# EAGLE design Ver.5 中継 (EAGLE 9.6.2)
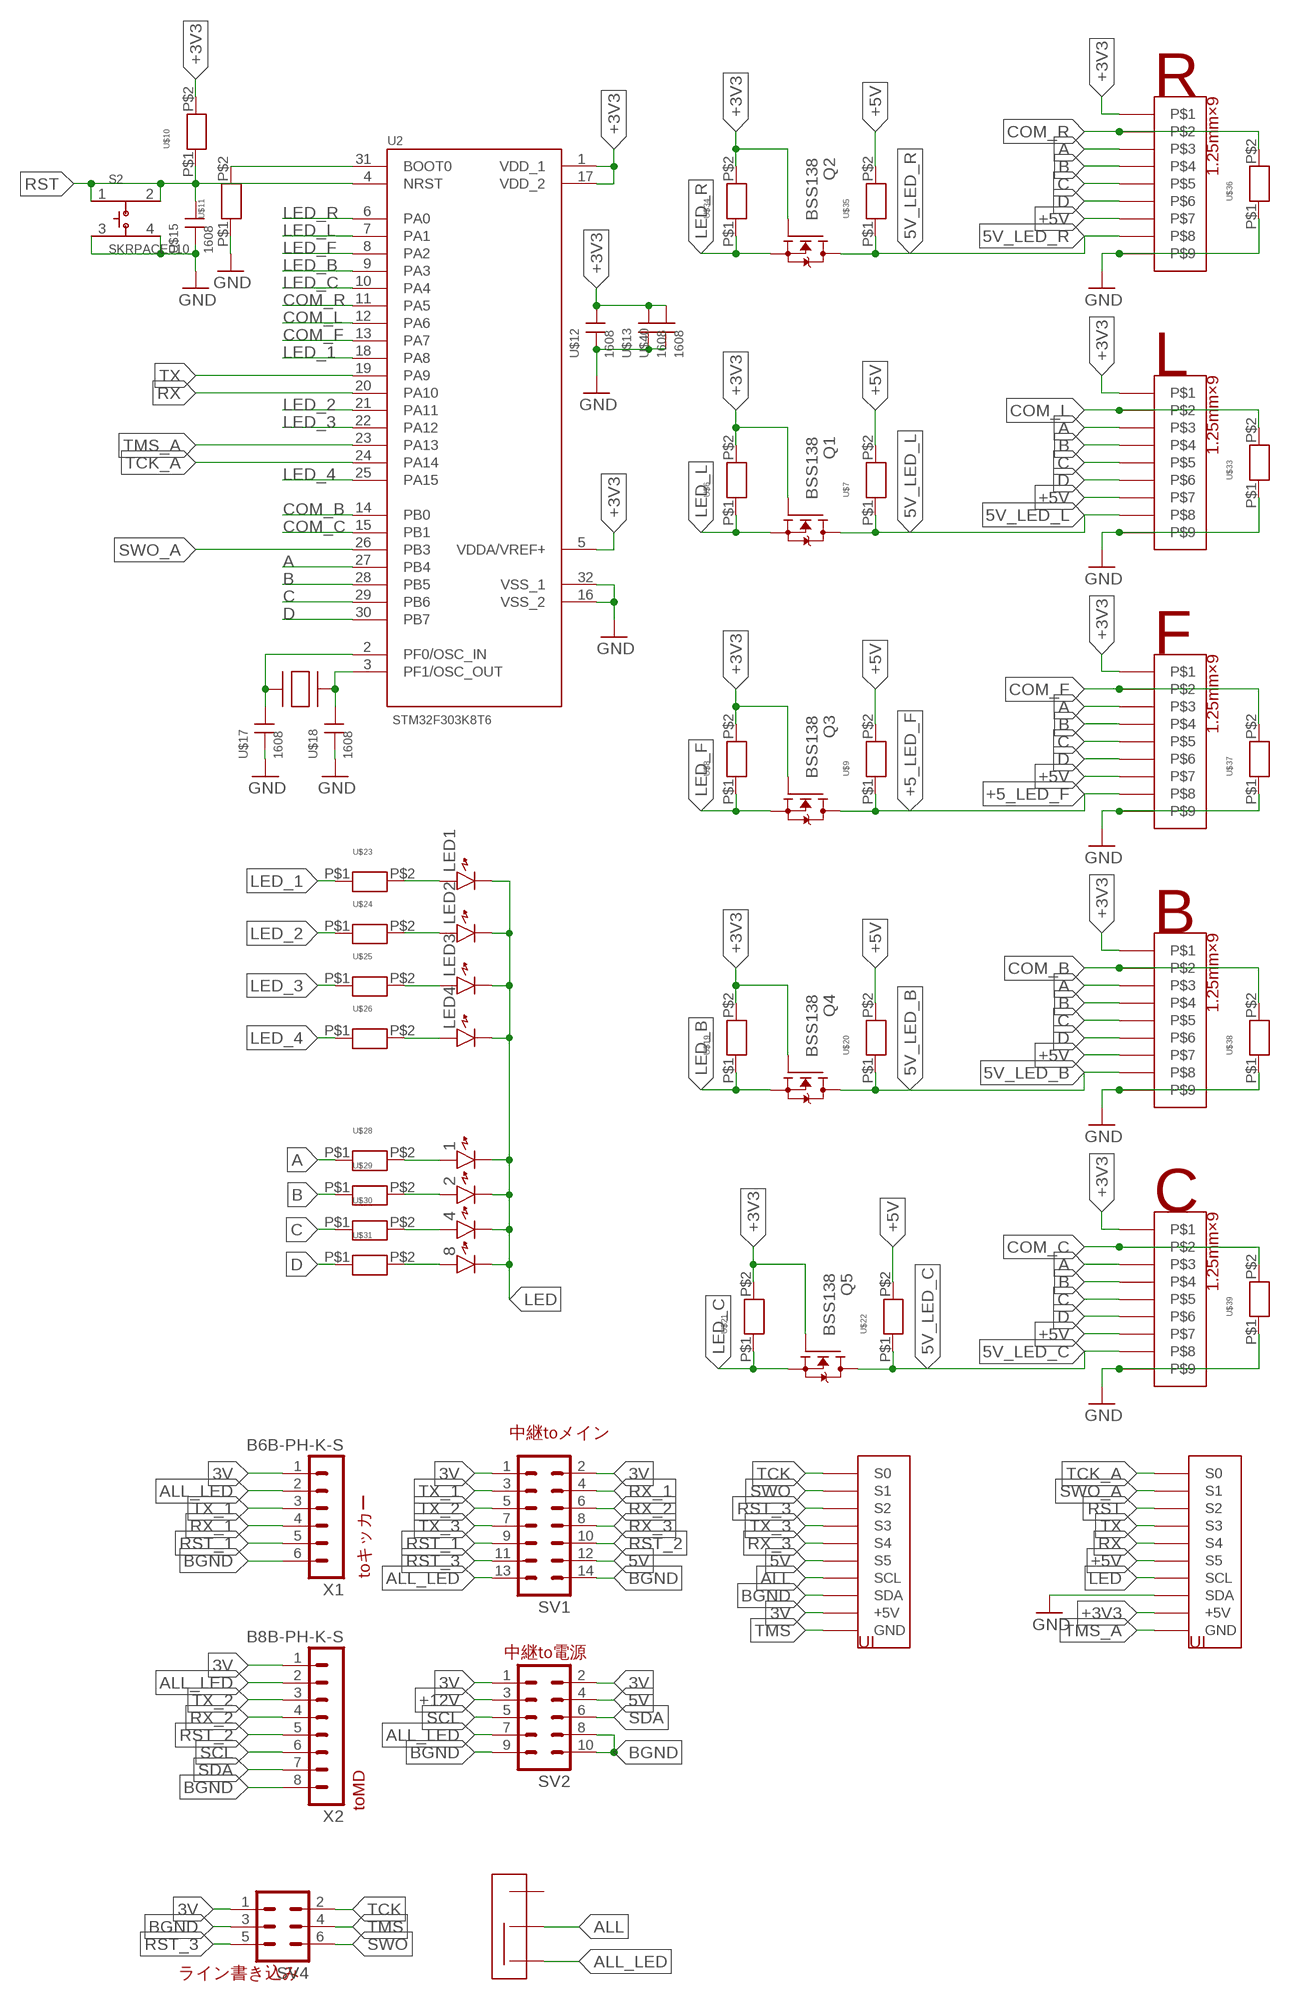
[diagram p0: schematic, sheet 1]

## Parts
1  LED1608  [LED1608]
2  LED1608  [LED1608]
4  LED1608  [LED1608]
8  LED1608  [LED1608]
LED1  LED1608  [LED1608]
LED2  LED1608  [LED1608]
LED3  LED1608  [LED1608]
LED4  LED1608  [LED1608]
Q1  BSS138  [SOT23]
Q2  BSS138  [SOT23]
Q3  BSS138  [SOT23]
Q4  BSS138  [SOT23]
Q5  BSS138  [SOT23]
S2  SKRPACE010  [SW_SKRPACE010]
SV1  ML14  [ML14]
SV2  ML10  [ML10]
SV4  ML6  [ML6]
U2  STM32F303K8T6  [QFP80P900X900X160-32N]
U$1  1MMCON  [1MMCON]
U$2  1MMCON  [1MMCON]
U$3  1MMCON  [1MMCON]
U$4  1MMCON  [1MMCON]
U$5  1MMCON  [1MMCON]
U$6  R  [1608]
U$7  R  [1608]
U$8  R  [1608]
U$9  R  [1608]
U$10  R  [1608]
U$11  R  [1608]
U$12  1608  [CON]
U$13  1608  [CON]
U$14  UI  [UI]
U$15  1608  [CON]
U$16  SUISYOU  [水晶]
U$17  1608  [CON]
U$18  1608  [CON]
U$19  R  [1608]
U$20  R  [1608]
U$21  R  [1608]
U$22  R  [1608]
U$23  R  [1608]
U$24  R  [1608]
U$25  R  [1608]
U$26  R  [1608]
U$27  UI  [UI]
U$28  R  [1608]
U$29  R  [1608]
U$30  R  [1608]
U$31  R  [1608]
U$32  SSW  [SSW]
U$33  R  [1608]
U$34  R  [1608]
U$35  R  [1608]
U$36  R  [1608]
U$37  R  [1608]
U$38  R  [1608]
U$39  R  [1608]
U$40  1608  [CON]
X1  B6B-PH-K-S  [B6B-PH-K-S]
X2  B8B-PH-K-S  [B8B-PH-K-S]

## Nets
3V: SV1.1 SV1.2 SV2.1 SV2.2 SV4.1 U$14.P$1(+5V) X1.1 X2.1
5V: SV1.12 SV2.4 U$14.P$8(S5)
5V_LED_B: Q4.3(D) U$4.P$8 U$20.P$1
5V_LED_C: Q5.3(D) U$5.P$8 U$22.P$1
5V_LED_L: Q1.3(D) U$2.P$8 U$7.P$1
5V_LED_R: Q2.3(D) U$1.P$8 U$35.P$1
+3V3 [New Class]: Q1.1(G) Q2.1(G) Q3.1(G) Q4.1(G) Q5.1(G) U2.1(VDD_1) U2.5(VDDA/VREF+) U2.17(VDD_2) U$1.P$1 U$2.P$1 U$3.P$1 U$4.P$1 U$5.P$1 U$6.P$2 U$8.P$2 U$10.P$2 U$12.P$1 U$13.P$1 U$19.P$2 U$21.P$2 U$27.P$1(+5V) U$34.P$2 U$40.P$1
+5_LED_F: Q3.3(D) U$3.P$8 U$9.P$1
+5V: U$1.P$7 U$2.P$7 U$3.P$7 U$4.P$7 U$5.P$7 U$7.P$2 U$9.P$2 U$20.P$2 U$22.P$2 U$27.P$8(S5) U$35.P$2
+12V: SV2.3
A: U2.27(PB4) U$1.P$3 U$2.P$3 U$3.P$3 U$4.P$3 U$5.P$3 U$28.P$1
ALL: U$14.P$9(SCL) U$32.P$3
ALL_LED [New Class]: SV1.13 SV2.7 U$32.P$1 X1.2 X2.2
B: U2.28(PB5) U$1.P$4 U$2.P$4 U$3.P$4 U$4.P$4 U$5.P$4 U$29.P$1
BGND: SV1.14 SV2.8 SV2.9 SV2.10 SV4.3 U$14.P$10(SDA) X1.6 X2.8
C: U2.29(PB6) U$1.P$5 U$2.P$5 U$3.P$5 U$4.P$5 U$5.P$5 U$30.P$1
COM_B: U2.14(PB0) U$4.P$2 U$38.P$2
COM_C: U2.15(PB1) U$5.P$2 U$39.P$2
COM_F: U2.13(PA7) U$3.P$2 U$37.P$2
COM_L: U2.12(PA6) U$2.P$2 U$33.P$2
COM_R: U2.11(PA5) U$1.P$2 U$36.P$2
D: U2.30(PB7) U$1.P$6 U$2.P$6 U$3.P$6 U$4.P$6 U$5.P$6 U$31.P$1
GND [New Class]: S2.3 S2.4 U2.16(VSS_2) U2.32(VSS_1) U$1.P$9 U$2.P$9 U$3.P$9 U$4.P$9 U$5.P$9 U$11.P$1 U$12.P$2 U$13.P$2 U$15.P$2 U$17.P$2 U$18.P$2 U$27.P$10(SDA) U$33.P$1 U$36.P$1 U$37.P$1 U$38.P$1 U$39.P$1 U$40.P$2
LED: 1.K 2.K 4.K 8.K LED1.K LED2.K LED3.K LED4.K U$27.P$9(SCL)
LED_1: U2.18(PA8) U$23.P$1
LED_2: U2.21(PA11) U$24.P$1
LED_3: U2.22(PA12) U$25.P$1
LED_4: U2.25(PA15) U$26.P$1
LED_B: Q4.2(S) U2.9(PA3) U$19.P$1
LED_C: Q5.2(S) U2.10(PA4) U$21.P$1
LED_F: Q3.2(S) U2.8(PA2) U$8.P$1
LED_L: Q1.2(S) U2.7(PA1) U$6.P$1
LED_R: Q2.2(S) U2.6(PA0) U$34.P$1
N$1: U2.31(BOOT0) U$11.P$2
N$2: U2.2(PF0/OSC_IN) U$16.P$1 U$17.P$1
N$3: U2.3(PF1/OSC_OUT) U$16.P$2 U$18.P$1
N$9: 8.A U$31.P$2
N$10: 4.A U$30.P$2
N$11: 2.A U$29.P$2
N$12: 1.A U$28.P$2
N$19: LED2.A U$24.P$2
N$20: LED1.A U$23.P$2
N$21: LED3.A U$25.P$2
N$22: LED4.A U$26.P$2
RST: S2.1 S2.2 U2.4(NRST) U$10.P$1 U$15.P$1 U$27.P$5(S2)
RST_1: SV1.9 X1.5
RST_2: SV1.10 X2.5
RST_3: SV1.11 SV4.5 U$14.P$5(S2)
RX: U2.20(PA10) U$27.P$7(S4)
RX_1: SV1.4 X1.4
RX_2: SV1.6 X2.4
RX_3: SV1.8 U$14.P$7(S4)
SCL: SV2.5 X2.6
SDA: SV2.6 X2.7
SWO: SV4.6 U$14.P$4(S1)
SWO_A: U2.26(PB3) U$27.P$4(S1)
TCK: SV4.2 U$14.P$3(S0)
TCK_A: U2.24(PA14) U$27.P$3(S0)
TMS: SV4.4 U$14.P$2(GND)
TMS_A: U2.23(PA13) U$27.P$2(GND)
TX: U2.19(PA9) U$27.P$6(S3)
TX_1: SV1.3 X1.3
TX_2: SV1.5 X2.3
TX_3: SV1.7 U$14.P$6(S3)
Unconnected: U$32.P$2

## Notes on the sheet
- R
- L
- F
- B
- C
- 中継toメイン
- toキッカー
- 中継to電源
- toMD
- ライン書き込み

## Library data of the parts
1 2 4 8 LED1-LED4 = generic:LED: Generic LEDs
Q1-Q5 = bss138_10:BSS138: BSS138 N-Channel Logic Level Enhancement Mode Field Effect Transistor Source: http://www.fairchildsemi.com/datasheets/BS/BSS138.pdf; MF: Fairchild; MPN: BSS138; OC_FARNELL: 9845330; OC_NEWARK: 67R2009
S2 = SKRPACE010:SKRPACE010: Switch Tactile N.O. SPST Button J-Bend 0.05A 16VDC 2.55N SMD Automotive T/R Check prices <https://pricing.snapeda.com/parts/SKRPACE010/ALPS/view-part?ref=eda>; AVAILABILITY: In Stock; DESCRIPTION: Switch Tactile N.O. SPST Button J-Bend 0.05A 16VDC 2.55N SMD Automotive T/R; MF: ALPS; MP: SKRPACE010; PACKAGE: None; PRICE: None
SV1 = con-ml:ML14: HARTING; OC_FARNELL: unknown; OC_NEWARK: unknown
SV2 = con-ml:ML10: HARTING; OC_FARNELL: unknown; OC_NEWARK: unknown
SV4 = con-ml:ML6: HARTING; OC_FARNELL: unknown; OC_NEWARK: unknown
U2 = STM32F303K8T6:STM32F303K8T6: Analog and DSP with FPU ARM Cortex-M4 MCU with 64 Kbytes Flash, 72 MHz CPU, CCM, 12-bit ADC 5 MSPS, comparators, op-amp Check availability <https://pricing.snapeda.com/parts/STM32F303K8T6/STMicroelectronics/view-part?ref=eda>; AVAILABILITY: In Stock; DESCRIPTION: ARM® Cortex®-M4 STM32F3 Microcontroller IC 32-Bit 72MHz 64KB (64K x 8) FLASH 32-LQFP (7x7); MF: STMicroelectronics; MP: STM32F303K8T6; PACKAGE: LQFP-32 STMicroelectronics; PRICE: None; PURCHASE-URL: https://pricing.snapeda.com/search/part/STM32F303K8T6/?ref=eda
U$1-U$5 = 9P_1.25mmCON:1MMCON
U$6-U$11 U$19-U$26 U$28-U$31 U$33-U$39 = R 1608:R
U$12 U$13 U$15 U$17 U$18 U$40 = con1608:1608
U$14 U$27 = UI:UI
U$16 = 水晶:SUISYOU
U$32 = SSW:SSW
X1 = con-JST PH:B6B-PH: JST PH series header 2.00mm pitch disconnectable crimp style connectors, vertical (side entry type), 6 pins
X2 = con-JST PH:B8B-PH: JST PH series header 2.00mm pitch disconnectable crimp style connectors, vertical (side entry type), 8 pins

## Net classes
1 New Class: width 0.254 mm

## Board
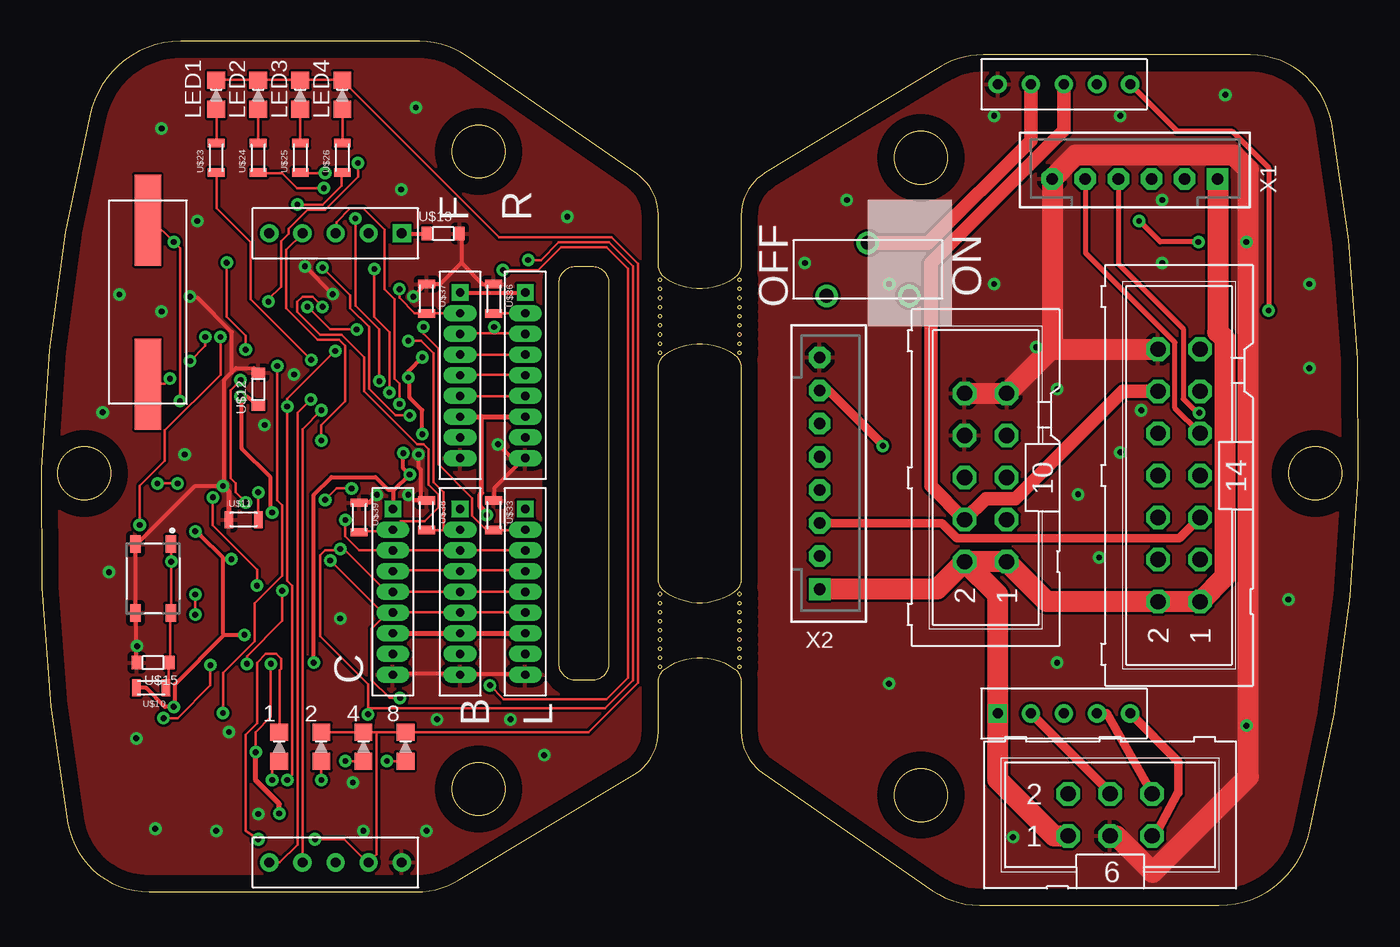
[diagram p1: board, top side]
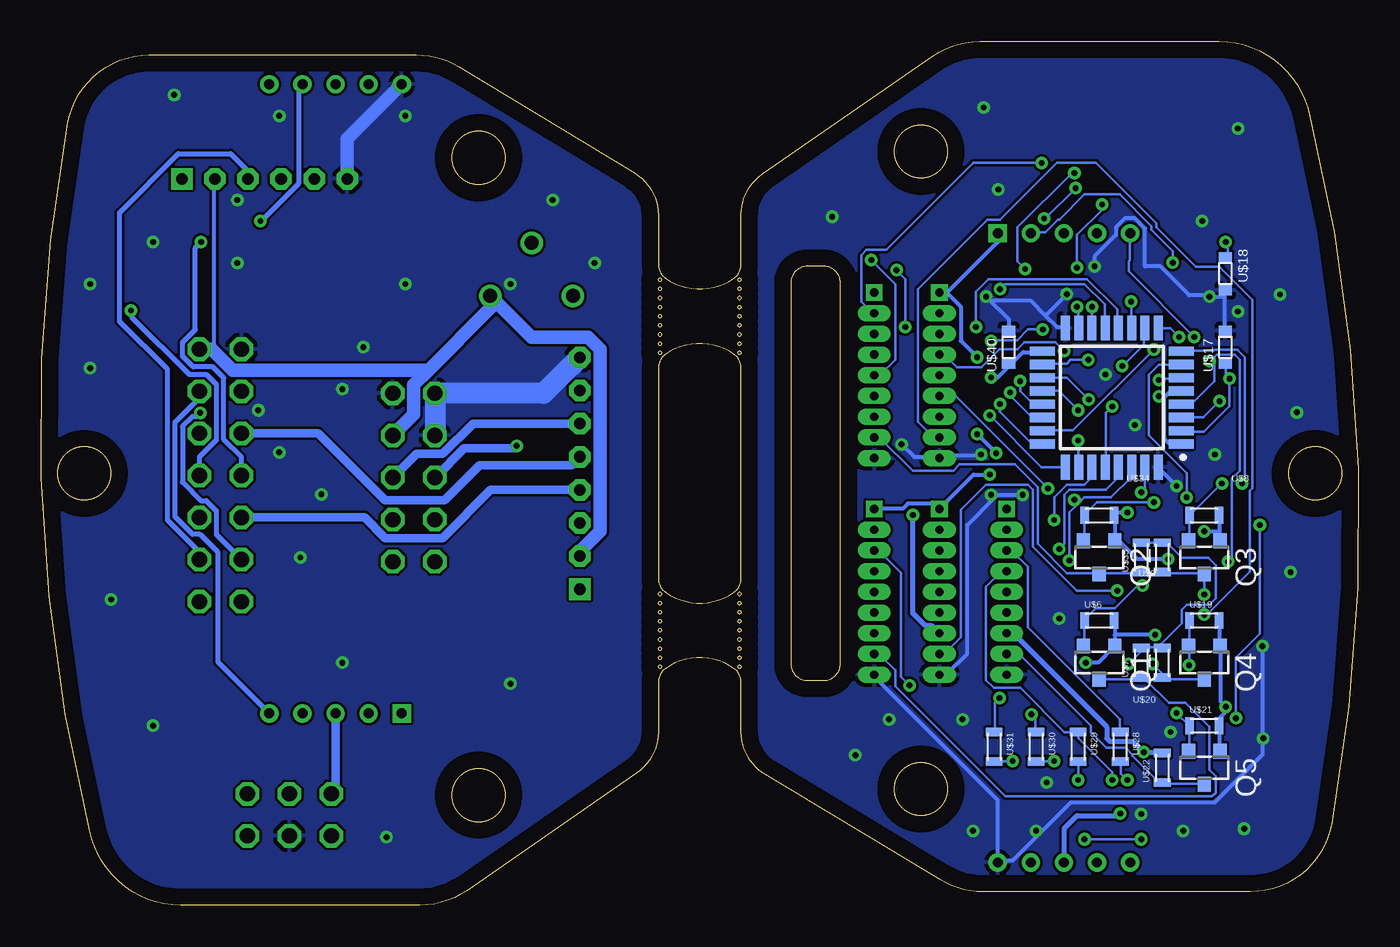
[diagram p2: board, bottom side, seen from below]

Size 79.54 x 52.17 mm. Coordinates in mm from the lower left corner, seen from the top.
Outline: 33.27,13.58 32.27,13.58 arc-90 31.27,14.58 31.27,37.58 arc-90 32.27,38.58 33.27,38.58 arc-90 34.27,37.58 34.27,14.58 arc-90 33.27,13.58
Outline: 37.7,14.3 arc-70 41.84,14.3 arc-55 42.27,13.48 42.27,10.47 arc55 43.56,8.01 53.84,0.89 arc35 56.69,0 71.14,0 arc79 76.62,4.51 arc24 77.94,47.25 arc80 73.02,51.36 56.9,51.36 arc31 54.31,50.64 43.72,44.22 arc59 42.27,41.66 42.27,38.69 arc-55 41.84,37.87 arc-70 37.7,37.87 arc-55 37.27,38.69 37.27,41.7 arc55 35.98,44.16 25.7,51.28 arc35 22.86,52.17 8.41,52.17 arc79 2.93,47.66 arc24 1.6,4.92 arc80 6.52,0.81 22.64,0.81 arc31 25.23,1.53 35.98,8.01 arc55 37.27,10.47 37.27,13.48 arc-55 37.7,14.3
Outline: 41.84,18.9 arc-70 37.7,18.9 arc-55 37.27,19.72 37.27,32.45 arc-55 37.7,33.27 arc-70 41.84,33.27 arc-55 42.27,32.45 42.27,19.72 arc-55 41.84,18.9
Outline: circle at 53.13,6.65 radius 1.6
Outline: circle at 42.17,14.4 radius 0.1
Outline: circle at 42.17,14.95 radius 0.1
Outline: circle at 42.17,15.5 radius 0.1
Outline: circle at 42.17,16.05 radius 0.1
Outline: circle at 42.17,16.6 radius 0.1
Outline: circle at 42.17,17.15 radius 0.1
Outline: circle at 42.17,17.7 radius 0.1
Outline: circle at 42.17,18.25 radius 0.1
Outline: circle at 42.17,18.8 radius 0.1
Outline: circle at 37.37,14.4 radius 0.1
Outline: circle at 37.37,14.95 radius 0.1
Outline: circle at 37.37,15.5 radius 0.1
Outline: circle at 37.37,16.05 radius 0.1
Outline: circle at 37.37,16.6 radius 0.1
Outline: circle at 37.37,17.15 radius 0.1
Outline: circle at 37.37,18.8 radius 0.1
Outline: circle at 37.37,18.25 radius 0.1
Outline: circle at 37.37,17.7 radius 0.1
Outline: circle at 42.17,33.92 radius 0.1
Copper layers (1*16): Top 0.035mm / dielectric 1.5mm / Bottom 0.035mm
Design rules "default": minimum track width 6mil, minimum drill 0.35mm, track to track 6mil, track to pad 6mil, pad to pad 6mil, via to via 6mil, smd to smd 6mil, copper to edge 40mil, drill to drill 6mil, minimum pad ring 10mil, minimum via ring 8mil, stop-mask expansion 4mil, vias tented up to drill 0mil, thermal gap 10mil

### Footprints (pad centres in the part's own frame; a part is rotated, then mirrored left to right if it is on the bottom)
LED1608 = smd 1.05 x 1.08: A -0.875,0; K 0.875,0
SOT23 = smd 0.8 x 0.9: 1 -0.95,-1; 2 0.95,-1; 3 0,1
SW_SKRPACE010 = smd 1.05 x 0.65: 1 -2.075,1.075; 2 2.075,1.075; 3 -2.075,-1.075; 4 2.075,-1.075
ML14 = drill 0.914 octagon: 1 -7.62,-1.27; 2 -7.62,1.27; 3 -5.08,-1.27; 4 -5.08,1.27; 5 -2.54,-1.27; 6 -2.54,1.27; 7 0,-1.27; 8 0,1.27; 9 2.54,-1.27; 10 2.54,1.27; 11 5.08,-1.27; 12 5.08,1.27; 13 7.62,-1.27; 14 7.62,1.27
ML10 = drill 0.914 octagon: 1 -5.08,-1.27; 2 -5.08,1.27; 3 -2.54,-1.27; 4 -2.54,1.27; 5 0,-1.27; 6 0,1.27; 7 2.54,-1.27; 8 2.54,1.27; 9 5.08,-1.27; 10 5.08,1.27
ML6 = drill 0.914 octagon: 1 -2.54,-1.27; 2 -2.54,1.27; 3 0,-1.27; 4 0,1.27; 5 2.54,-1.27; 6 2.54,1.27
QFP80P900X900X160-32N = smd 1.5 x 0.55: 1 -4.2,2.8; 2 -4.2,2; 3 -4.2,1.2; 4 -4.2,0.4; 5 -4.2,-0.4; 6 -4.2,-1.2; 7 -4.2,-2; 8 -4.2,-2.8; 17 4.2,-2.8; 18 4.2,-2; 19 4.2,-1.2; 20 4.2,-0.4; 21 4.2,0.4; 22 4.2,1.2; 23 4.2,2; 24 4.2,2.8 | smd 0.55 x 1.5: 9 -2.8,-4.2; 10 -2,-4.2; 11 -1.2,-4.2; 12 -0.4,-4.2; 13 0.4,-4.2; 14 1.2,-4.2; 15 2,-4.2; 16 2.8,-4.2; 25 2.8,4.2; 26 2,4.2; 27 1.2,4.2; 28 0.4,4.2; 29 -0.4,4.2; 30 -1.2,4.2; 31 -2,4.2; 32 -2.8,4.2
1MMCON = drill 0.5 square: P$1 0,0 | drill 0.5 long: P$2 1.25,0; P$3 2.5,0; P$4 3.75,0; P$5 5,0; P$6 6.25,0; P$7 7.5,0; P$8 8.75,0; P$9 10,0
1608 = smd 0.508 x 1.016: P$1 -0.889,0; P$2 0.889,0
CON = smd 0.6 x 0.813: P$1 -1,0; P$2 1,0
UI = drill 0.6 square: P$1 1,-1.5 | drill 0.6: P$2 3,-1.5; P$3 5,-1.5; P$4 7,-1.5; P$5 9,-1.5; P$6 9,36.5; P$7 7,36.5; P$8 5,36.5; P$9 3,36.5; P$10 1,36.5
水晶 = smd 5.5 x 1.6: P$1 1.2,2.35; P$2 11.1,2.35
SSW = drill 0.85: P$1 -2.5,1.6; P$2 2.5,1.6; P$3 0,-1.6
B6B-PH-K-S = drill 0.7 pad 1.3 square: 1 5,0 | drill 0.7 pad 1.3 octagon: 2 3,0; 3 1,0; 4 -1,0; 5 -3,0; 6 -5,0
B8B-PH-K-S = drill 0.7 pad 1.3 square: 1 7,0 | drill 0.7 pad 1.3 octagon: 2 5,0; 3 3,0; 4 1,0; 5 -1,0; 6 -3,0; 7 -5,0; 8 -7,0

### Placement (x,y rotation side)
1  14.37,9.57 90 top
2  16.91,9.57 90 top
4  19.45,9.57 90 top
8  21.99,9.57 90 top
LED1  10.56,48.94 90 top
LED2  13.1,48.94 90 top
LED3  15.64,48.94 90 top
LED4  18.18,48.94 90 top
Q1  15.64,14.65 180 bottom
Q2  15.64,21 180 bottom
Q3  9.29,21 180 bottom
Q4  9.29,14.65 180 bottom
Q5  9.29,8.3 180 bottom
S2  6.75,19.73 270 top
SV1  68.73,25.96 90 top
SV2  57.04,25.83 90 top
SV4  64.56,5.46 0 top
U2  14.88,30.66 180 bottom
U$1  29.23,37.01 270 top
U$2  29.23,23.93 270 top
U$3  25.29,37.01 270 top
U$4  25.29,23.93 270 top
U$5  21.23,23.93 270 top
U$6  15.64,17.19 0 bottom
U$7  13.1,14.65 90 bottom
U$8  9.29,23.54 0 bottom
U$9  11.83,21 90 bottom
U$10  6.63,13.13 180 top
U$11  12.21,23.29 0 top
U$12  13.1,31.16 90 top
U$13  24.28,40.56 0 top
U$14  56.77,13.08 0 top
U$15  6.75,14.65 180 top
U$16  8.78,30.28 90 top
U$17  8.02,33.7 90 bottom
U$18  8.02,38.15 270 bottom
U$19  9.29,17.19 0 bottom
U$20  11.83,14.65 90 bottom
U$21  9.29,10.84 0 bottom
U$22  11.83,8.3 90 bottom
U$23  10.56,45.13 90 top
U$24  13.1,45.13 90 top
U$25  15.64,45.13 90 top
U$26  18.18,45.13 90 top
U$27  22.77,39.08 180 top
U$28  14.37,9.57 270 bottom
U$29  16.91,9.57 270 bottom
U$30  19.45,9.57 270 bottom
U$31  21.99,9.57 270 bottom
U$32  49.93,38.4 180 top
U$33  27.33,23.54 270 top
U$34  15.64,23.54 0 bottom
U$35  13.1,21 90 bottom
U$36  27.33,36.63 270 top
U$37  23.26,36.63 270 top
U$38  23.26,23.54 270 top
U$39  19.2,23.42 270 top
U$40  21.1,33.7 90 bottom
X1  66.06,43.86 0 top
X2  47.01,26.08 270 top

### Tracks (layer width: path | path; a pad name or v marks a point on that pad's centre or on a via)
3V
  Top 1.27: X1.1 71.06,34.63 71.5,34.2 71.5,19.84 SV1.1 SV1.2 60.73,18.34 SV2.1 SV2.2 | SV2.2 54.11,19.08 X2.1 | SV2.2 57.77,18.75 U$14.P$1 57.77,7.58 61.18,4.17 62.04,4.17 SV4.1
5V
  Top 0.813: SV1.12 65.32,31.04 58.84,24.56 57.04,24.56 SV2.4 53.74,25.32 53.74,38.78 61.77,46.81 U$14.P$8
5V_LED_B  (via drill 0.35)
  Top 0.152: v12.42,14.58 12.42,15.04 14.55,17.17 v14.55,19
  Bottom 0.152: Q4.3 11.73,13.66 U$20.P$1 11.88,13.82 11.88,14.04 v12.42,14.58 | v14.55,19 16.99,19 19.66,21.66 19.66,25.09 19.96,25.4 22.48,25.4 24,23.87 24,16.18 24.99,15.19 25.29,15.19 U$4.P$8
5V_LED_C
  Bottom 0.152: Q5.3 9.29,7.34 11.73,7.34 11.81,7.42 U$22.P$1 12.04,7.42 13.64,9.02 13.64,9.09 14.04,9.5 15.21,9.5 16.15,10.44 16.15,10.84 20.42,15.11 21.18,15.11 U$5.P$8
5V_LED_L
  Bottom 0.152: Q1.3 15.62,13.66 13.18,13.66 13.1,13.74 U$7.P$1 13.1,13.66 12.87,13.66 11.43,12.22 10.44,12.22 8.99,10.77 8.99,8.18 8.61,7.8 8.61,6.81 8.84,6.58 21.31,6.58 27.96,13.23 27.96,14.2 28.88,15.11 29.18,15.11 U$2.P$8
5V_LED_R
  Bottom 0.152: U$35.P$1 13.1,20.06 15.62,20.06 Q2.3 15.69,20.06 17.6,20.06 19.35,21.82 19.35,25.25 20.72,26.62 24.08,26.62 24.46,26.24 26.89,26.24 28.88,28.22 29.18,28.22 U$1.P$8
+3V3  (via drill 0.35)
  Top 0.254: U$13.P$1 21.79,40.56 U$27.P$1 | v23.01,33.09 22.17,32.26 v22.17,31.88 22.25,31.8 22.25,30.66 23.01,29.89 v23.01,28.45 | U$1.P$1 29.18,36.98 25.29,36.98 U$3.P$1 | U$12.P$1 12.41,30.73 v12.04,30.73 12.11,30.66 12.11,27.58 13.81,25.88 13.81,23.85 v13.94,23.72 | 21.26,25.02 21.26,23.95 U$5.P$1 | 21.26,25.02 v22.25,26.01 21.87,26.39 v21.87,27.3 | U$10.P$2 6.32,13.13 7.46,11.99 v8,11.99 8.07,12.06 8.07,13.36 11.05,16.33 | 11.05,16.33 v12.26,16.33 | v9.29,22.58 9.52,22.35 9.6,22.35 10.97,20.98 | 10.97,20.98 10.97,16.41 11.05,16.33 | v11.48,20.9 11.05,20.9 10.97,20.98 | v16.46,14.65 16.46,24.79 17.52,25.86 20.19,25.86 20.95,25.09 21.18,25.09 21.26,25.02
  Bottom 0.254: 20.96,32.68 21.76,31.88 v22.17,31.88 | 20.96,32.68 20.24,33.4 19.12,33.4 U2.17 | v23.01,33.09 24,34.09 24,36.14 24.84,36.98 | 24.84,36.98 25.29,36.98 U$3.P$1 | 24.84,36.98 21.79,40.03 21.79,40.56 U$27.P$1 | U2.5 10.74,31.04 11.35,31.04 11.65,30.73 v12.04,30.73 11.73,30.66 11.73,28.22 11.43,27.91 10.74,27.91 U2.1 | v22.25,26.01 23.24,26.01 25.29,23.95 U$4.P$1 25.37,24.03 25.6,24.26 27.2,24.26 27.5,23.95 29.18,23.95 U$2.P$1 | 8.38,22.58 8.38,23.49 U$8.P$2 | 8.38,22.58 8.38,22.05 Q3.1 | 14.7,16.33 14.7,17.17 U$6.P$2 | 14.7,16.33 14.7,15.72 Q1.1 14.78,15.57 15.69,14.65 v16.46,14.65 | U$19.P$2 8.38,17.17 8.38,15.72 Q4.1 8.3,15.57 8.3,12.29 v8,11.99 8,11.68 8.3,11.38 8.3,10.92 U$21.P$2 8.38,10.84 8.38,9.32 Q5.1 | v12.26,16.33 14.7,16.33 | v9.29,22.58 8.38,22.58 | v11.48,20.9 13.33,20.9 14.32,21.89 14.63,21.89 Q2.1 14.7,22.05 14.7,23.49 U$34.P$2 14.63,23.57 14.47,23.72 v13.94,23.72 | v21.87,27.3 v23.01,28.45 | U$40.P$1 21.07,32.68 20.96,32.68
+5_LED_F  (via drill 0.35)
  Top 0.152: v9.29,17.55 v9.29,18.77
  Bottom 0.152: U$9.P$1 11.81,20.06 9.29,20.06 Q3.3 v9.29,18.77 | v9.29,17.55 9.14,17.55 6.55,20.14 6.55,25.02 6.4,25.17 6.4,36.57 8.38,38.56 9.8,38.56 12.19,40.94 12.19,41.17 15.85,44.83 18.21,44.83 21.64,41.4 22.4,41.4 26.59,37.21 26.59,29.21 25.68,28.29 25.29,28.29 U$3.P$8
+5V  (via drill 0.35)
  Top 0.152: 26.59,29.51 U$3.P$7 | 29.18,29.51 U$1.P$7 | U$2.P$7 29.18,16.41 25.29,16.41 U$4.P$7 | v13.86,14.58 13.86,11.38 12.95,10.46 v12.95,9.24
  Top 0.305: U$3.P$7 26.59,29.51 | 26.59,29.51 29.18,29.51 | U$5.P$7 25.28,16.43 25.29,16.41 | U$4.P$7 29.16,16.43 29.18,16.41 | v26.89,23.57 26.89,23.67 26.51,24.05 26.51,24.81 26.61,24.91 26.61,29.5 26.59,29.51 | v12.95,9.24 12.95,7.54 14.37,6.12 v14.37,5.54
  Bottom 0.152: U$35.P$2 U$9.P$2 11.55,21.89 10.64,20.98 9.06,20.98 8.61,20.52 8.61,18.54 8.99,18.16 10.36,18.16 10.66,17.85 10.66,17.02 11.88,15.8 11.88,15.65 U$20.P$2 11.88,15.57 13.1,15.57 U$7.P$2 13.1,15.34 v13.86,14.58 | 11.88,9.24 U$22.P$2 | 26.89,23.54 v26.89,23.57
  Bottom 0.305: U$4.P$7 25.74,16.87 26.13,16.87 26.89,17.63 26.89,23.54 | U$5.P$7 20.83,16.43 15.19,10.78 15.19,10.08 15.01,9.9 13.61,9.9 v12.95,9.24 11.88,9.24 | v14.37,5.54 14.5,5.41 16.98,5.41 17.77,4.62 U$27.P$8
A  (via drill 0.35)
  Top 0.152: 27.35,34.54 29.18,34.54 U$1.P$3 | 27.35,34.54 25.29,34.54 U$3.P$3 | 25.29,21.44 29.18,21.44 U$2.P$3 | v18.36,23.27 18.36,22.27 19.2,21.44 21.18,21.44 U$5.P$3 21.26,21.44 25.29,21.44 | 25.29,21.44 U$4.P$3 | v27.35,34.92 27.35,34.54 | v27.89,38.35 30.02,38.35 31.39,39.72 34.13,39.72 35.43,38.43 35.43,13.74 34.13,12.44 27.94,12.44 v27.1,13.28
  Bottom 0.152: U$28.P$1 14.4,10.46 14.4,11.23 19.96,16.79 19.96,20.45 20.87,21.36 21.18,21.36 U$5.P$3 | v18.36,23.27 18.36,24.64 17.6,25.4 16.53,25.4 16.15,25.78 16.15,26.39 U2.27 | v27.35,34.92 27.35,37.82 v27.89,38.35 | v27.1,13.28 27.61,13.79 27.61,20.09 28.88,21.36 29.18,21.36 U$2.P$3
ALL
  Top 0.813: U$14.P$9 59.77,46.18 53.6,40 U$32.P$3
ALL_LED
  Bottom 0.254: X1.2 69.11,43.84 69.11,33.93 69.25,33.58
  Bottom 0.813: SV2.7 57.04,29.64 57.04,31.44 56.16,32.32 | 56.16,32.32 52.43,36.05 U$32.P$1 49.92,34.29 46.51,34.29 45.8,33.59 45.8,22.58 47.01,21.37 X2.2 | SV1.13 69.25,33.58 67.98,32.31 66.93,32.31 66.92,32.32 56.16,32.32
B  (via drill 0.35)
  Top 0.152: v17.75,33.48 14.86,30.58 v14.86,30.12 14.86,19.61 15.16,19.3 15.16,7.87 v14.86,7.57 | U$1.P$4 29.18,33.25 U$3.P$4 | 25.29,20.22 29.18,20.22 U$2.P$4 | 25.29,20.22 21.26,20.22 U$5.P$4 | 25.29,20.22 U$4.P$4
  Bottom 0.152: v14.86,30.12 15.24,29.74 15.24,26.47 U2.28 | v17.75,33.48 18.28,34.01 20.16,34.01 20.6,33.58 21.67,33.58 22.76,32.49 24.23,32.49 24.99,33.25 U$3.P$4 | U$5.P$4 21.26,20.14 21.56,20.14 22.48,19.23 22.48,13.59 22.02,13.13 20.42,13.13 17.75,10.46 U$29.P$1 16.91,10.08 14.86,8.03 v14.86,7.57
BGND  (via drill 0.35)
  Top 1.27: SV2.10 SV2.9 60.98,33.58 | 60.98,33.58 SV1.14 | 60.98,33.58 61.06,33.66 X1.6 61.62,44.43 61.62,44.46 62.47,45.3 72.04,45.3 72.92,44.42 72.92,7.77 67.14,1.99 64.94,4.19 SV4.3
  Bottom 0.813: U$14.P$10 61.06,46.3 X1.6
  Bottom 1.27: X2.8 47.57,32.52 47.61,32.52 49.22,30.91 SV2.10 SV2.8
  other vias: 51.2,13.38 61.36,14.65 72.79,10.84 58.7,4.11 62.63,24.81 65.17,27.35 66.44,29.89 63.9,21 61.36,31.16 60.09,33.7 57.55,37.51 51.2,37.51 46.12,38.78 48.66,42.59 57.55,47.67 65.17,47.67 71.52,48.94 76.6,37.51 76.6,32.43 67.71,38.78 67.71,42.59 72.79,40.05 75.33,18.46
  pour Bottom: 41.04,64.18 84.22,64.18 84.22,-8.21 41.04,-8.21
  pour Top: 41.04,64.18 41.04,-8.21 84.22,-8.21 84.22,64.18
C  (via drill 0.35)
  Top 0.152: U$3.P$5 25.29,32.03 29.18,32.03 U$1.P$5 | U$4.P$5 29.18,18.92 U$2.P$5 | 19.73,11.91 19.73,13.36 16.84,16.25 16.84,21.13 17.14,21.44 18.06,21.44 | 19.73,11.91 v19.73,11.53 | 18.06,21.44 18.36,21.44 20.8,19 21.18,19 U$5.P$5 21.26,18.92 U$4.P$5 | 18.06,21.44 v18.06,21.51 | U$4.P$5 | v29.41,38.96 30.17,38.96 31.24,40.03 34.29,40.03 35.73,38.58 35.73,13.59 34.06,11.91 19.73,11.91
  Bottom 0.152: v19.73,11.53 19.5,11.3 19.5,10.46 U$30.P$1 | v18.06,21.51 17.75,21.82 17.75,24.79 17.45,25.09 15.24,25.09 14.55,25.78 14.55,26.39 U2.29 | v29.41,38.96 27.96,37.51 27.96,32.94 28.88,32.03 29.18,32.03 U$1.P$5
COM_B  (via drill 0.35)
  Top 0.152: 24.3,22.66 25.29,22.66 U$4.P$2 24.3,22.66 | 24.3,22.66 U$38.P$2 | v16.07,36.14 17.45,34.77 v19.05,34.77 | v22.17,34.09 22.93,34.09 23.69,33.32 23.69,25.55 24.3,24.94 24.3,22.66
  Bottom 0.152: v16.07,36.14 16.07,34.92 U2.14 | v19.05,34.77 19.94,34.77 20.57,34.14 22.12,34.14 v22.17,34.09
COM_C  (via drill 0.35)
  Top 0.152: U$39.P$2 19.2,22.58 21.1,22.58 21.18,22.66 U$5.P$2 21.26,22.73 21.71,23.19 23.16,23.19 24,24.03 24,24.79 23.39,25.4 23.39,27.53 23.08,27.84 22.7,27.84 19.5,31.04 19.5,33.09 18.13,34.47 16.84,34.47 15.46,35.84 15.46,36.45 15.77,36.75 16.38,36.75 v16.99,36.14
  Bottom 0.152: v16.99,36.14 16.91,36.07 16.91,34.92 U2.15
COM_F  (via drill 0.35)
  Top 0.152: U$3.P$2 23.31,35.76 U$37.P$2 23.24,35.76 22.55,35.76 21.64,36.68 v21.64,37.21
  Bottom 0.152: v21.64,37.21 21.33,37.51 16.53,37.51 15.31,36.3 15.31,34.92 U2.13
COM_L  (via drill 0.35)
  Top 0.152: U$2.P$2 29.18,22.66 U$33.P$2 26.89,22.66 26.03,23.52 26.03,24.59 24,26.62 24,33.6 23.08,34.52 v23.08,34.92
  Bottom 0.152: v23.08,34.92 23.08,37.06 22.32,37.82 16.38,37.82 14.55,35.99 14.55,34.92 U2.12
COM_R  (via drill 0.35)
  Top 0.152: U$36.P$2 27.35,35.76 29.18,35.76 U$1.P$2 | v13.71,36.45 13.71,36.6 14.47,37.36 14.47,40.11 14.93,40.56 14.93,40.87 16.07,42.01 17.14,42.01 19.12,43.99 v19.12,44.83
  Bottom 0.152: v13.71,36.45 13.71,34.92 U2.11 | v19.12,44.83 23.24,44.83 28.49,39.57 29.71,39.57 30.02,39.27 30.02,36.45 29.26,35.69 U$1.P$2
D  (via drill 0.35)
  Top 0.152: U$3.P$6 25.29,30.73 29.18,30.73 U$1.P$6 | 25.29,17.7 29.18,17.7 U$2.P$6 | v21.66,12.52 21.03,12.52 19.96,13.59 19.96,16.71 20.87,17.63 21.18,17.63 U$5.P$6 | v17.45,20.83 20.72,17.55 U$5.P$6 | 25.29,17.7 21.26,17.7 U$5.P$6 | 25.29,17.7 U$4.P$6 | v18.74,25.17 17.83,25.17 v17.14,24.48
  Bottom 0.152: v21.66,12.52 21.94,12.24 21.94,10.46 U$31.P$1 | 16.91,24.26 17.45,23.72 v17.45,20.83 | 16.91,24.26 16.53,24.64 14.93,24.64 13.71,25.86 13.71,26.39 U2.30 | v18.74,25.17 24.3,30.73 25.29,30.73 U$3.P$6 | 16.91,24.26 v17.14,24.48
GND  (via drill 0.35)
  Top 0.254: 28.8,26.62 29.18,27 U$1.P$9 | 28.8,26.62 27.35,25.17 27.35,24.48 U$33.P$1 | 28.8,26.62 v27.58,27.84 | v20.27,24.79 19.81,24.33 19.2,24.33 U$39.P$1 | v22.17,24.79 22.48,24.48 23.24,24.48 U$38.P$1 22.93,24.56 22.93,26.31 22.78,26.47 v22.78,27.23 | U$5.P$9 21.26,13.97 25.29,13.97 U$4.P$9 25.37,13.97 29.18,13.97 U$2.P$9 | U$13.P$2 25.37,40.47 25.37,38.81 | 25.37,38.81 24.08,37.51 U$37.P$1 23.16,37.44 v22.48,36.75 | U$36.P$1 26.67,37.51 25.37,38.81 | 5.71,15.65 5.71,17.63 S2.4 5.71,17.78 5.71,21.74 S2.3 5.79,21.82 9.29,25.32 v10.97,25.32 11.05,25.4 11.05,31.72 11.5,32.18 | 5.71,15.65 5.71,14.65 U$15.P$2 | 11.5,32.18 11.5,34.62 9.44,36.68 9.06,36.68 v8.99,36.75 | v15.92,38.58 v17.6,36.9 | v5.79,15.65 5.71,15.65 | 11.5,32.18 11.76,32.43 12.83,32.43 U$12.P$2
  Top 0.305: v10.97,25.32 11.32,24.97 U$11.P$1
  Bottom 0.254: v27.58,27.84 26.82,27.08 25.29,27.08 U$3.P$9 25.22,27.15 22.86,27.15 v22.78,27.23 | v20.27,24.79 21.79,24.79 21.98,24.6 | 21.98,24.6 23.62,22.96 23.62,15.19 24.84,13.97 25.29,13.97 U$4.P$9 | 21.98,24.6 v22.17,24.79 | U$2.P$9 29.18,13.89 29.18,13.77 21.77,6.36 U$27.P$10 21.71,2.69 20.87,2.69 17.37,6.2 8.68,6.2 5.79,9.09 v5.79,15.65 | 18.89,35.61 19.81,36.52 22.25,36.52 v22.48,36.75 21.1,35.38 U$40.P$2 | 18.89,35.61 18.21,34.92 17.75,34.92 U2.16 | U$17.P$2 8.07,34.77 8.07,37.11 U$18.P$2 8.13,36.75 v8.99,36.75 9.06,36.83 10.21,36.83 11.96,38.58 12.87,38.58 12.87,40.87 13.48,41.48 14.09,41.48 14.63,40.94 14.63,40.49 15.92,39.19 v15.92,38.58 | v10.97,25.32 12.04,26.39 U2.32 | v17.6,36.9 18.89,35.61
  other vias: 10.56,4.49 19.45,4.49 23.26,4.49 18.82,7.42 28.34,11.23 30.37,9.07 23.9,11.23 18.06,17.32 4.09,20.12 5.74,10.08 6.88,4.62 31.77,41.58 21.74,43.23 22.63,48.18 7.26,46.91 9.42,41.32 4.72,36.88 7.26,35.86 8.66,27.23 13.48,29.01 15.26,32.05 3.7,29.77 11.32,10.46 13.1,5.51
  pour Bottom: -7.22,64.18 -7.22,-8.21 34.69,-8.21 38.5,-8.21 38.5,51.48 38.5,64.18
  pour Top: -7.22,64.18 -7.22,-8.21 38.5,-8.21 38.5,64.18
LED  (via drill 0.35)
  Top 0.152: 13.1,49.86 10.59,49.86 LED1.K | 13.1,49.86 15.62,49.86 LED3.K 15.69,49.86 18.13,49.86 LED4.K 18.21,49.78 27.66,40.33 34.44,40.33 36.04,38.73 36.04,13.44 33.07,10.46 22.02,10.46 8.K 21.94,10.46 20.27,10.46 | 13.1,49.86 LED2.K | 2.K 16.91,10.46 19.43,10.46 4.K 19.5,10.46 20.27,10.46 | 1.K 14.4,10.46 14.4,14.2 14.47,14.27 14.47,14.88 14.17,15.19 13.56,15.19 13.03,14.65 13.03,11 12.34,10.31 12.34,4.49 v13.1,3.99 | 20.27,10.46 20.27,3.07 19.81,2.61 U$27.P$9 19.73,2.54 18.28,3.99 v16.53,3.99
  Bottom 0.152: v13.1,3.99 v16.53,3.99
LED_1  (via drill 0.35)
  Top 0.152: v16.3,32.94 12.65,36.6 12.65,40.03 10.59,42.09 10.59,44.22 U$23.P$1
  Bottom 0.152: v16.3,32.94 17.37,32.94 17.6,32.71 19.05,32.71 U2.18
LED_2  (via drill 0.35)
  Top 0.152: v17.06,43.31 15.46,43.31 14.55,44.22 13.1,44.22 U$24.P$1 | v18.97,41.48 18.97,36.22 20.42,34.77 v20.42,31.65
  Bottom 0.152: v17.06,43.31 18.89,41.48 v18.97,41.48 | v20.42,31.65 20.42,31.04 19.66,30.28 19.12,30.28 U2.21
LED_3  (via drill 0.35)
  Top 0.152: v17.14,44.22 15.69,44.22 U$25.P$1 | v20.11,38.43 20.11,35.53 21.03,34.62 v21.03,30.96
  Bottom 0.152: v17.14,44.22 17.29,44.22 20.57,40.94 20.57,38.89 v20.11,38.43 | v21.03,30.96 21.03,30.81 19.73,29.51 19.12,29.51 U2.22
LED_4  (via drill 0.35)
  Top 0.152: v15.46,42.32 16.99,42.32 18.13,43.46 18.13,44.22 U$26.P$1 | v16.99,38.51 18.67,36.83 18.67,36.07 19.81,34.92 19.81,31.19 21.41,29.59 v22.25,29.59
  Bottom 0.152: v15.46,42.32 15.46,42.01 16.99,40.49 v16.99,38.51 | v22.25,29.59 19.12,26.47 17.75,26.47 U2.25
LED_B  (via drill 0.35)
  Top 0.152: v10.82,34.31 10.82,32.03 7.46,28.68 7.46,26.85 5.94,25.32 v5.94,22.96 | v7.39,11.3 8.23,11.3 10.21,13.28 v10.21,14.5
  Bottom 0.152: U$19.P$1 10.21,17.17 10.21,15.72 Q4.2 10.21,15.65 v10.21,14.5 | v10.82,34.31 11.35,34.85 12.04,34.85 U2.9 | v5.94,22.96 5.94,16.41 7.39,14.96 v7.39,11.3
LED_C  (via drill 0.35)
  Top 0.152: v14.25,32.56 14.25,24.46 14.55,24.15 14.55,19.91 12.87,18.24 12.87,15.95 10.97,14.04 v10.97,11.61
  Bottom 0.152: 10.21,10.84 10.21,9.32 Q5.2 | v14.25,32.56 12.95,33.86 12.95,34.85 U2.10 | 10.21,10.84 v10.97,11.61 | 10.21,10.84 U$21.P$1
LED_F  (via drill 0.35)
  Top 0.152: v8.23,25.47 v7.01,25.47
  Bottom 0.152: Q3.2 10.21,22.05 10.21,23.49 U$8.P$1 10.13,23.57 v8.23,25.47 | v7.01,25.47 6.85,25.63 6.85,33.09 7.31,33.55 8.68,33.55 8.76,33.48 10.66,33.48 U2.8
LED_L  (via drill 0.35)
  Top 0.152: v10.36,24.64 10.36,22.93 13.03,20.27 v13.03,19.3
  Bottom 0.152: Q1.2 16.53,15.72 U$6.P$1 16.53,17.25 15.85,17.93 14.7,17.93 13.33,19.3 v13.03,19.3 | v10.36,24.64 10.36,26.08 12.65,28.37 12.65,32.03 12.04,32.64 10.74,32.64 U2.7
LED_R  (via drill 0.35)
  Top 0.152: v12.04,31.72 11.43,31.11 11.43,25.78 11.73,25.47 11.73,24.94 v12.34,24.33
  Bottom 0.152: Q2.2 16.53,22.05 U$34.P$1 16.53,23.57 15.77,24.33 v12.34,24.33 | v12.04,31.72 11.96,31.8 10.74,31.8 U2.6
N$1  (via drill 0.35)
  Top 0.152: U$11.P$2 v13.1,24.94
  Bottom 0.152: U2.31 12.87,26.39 12.87,25.86 12.87,25.17 v13.1,24.94
N$2  (via drill 0.35)
  Top 0.152: 6.47,31.49 6.78,31.8 | 6.47,31.49 U$16.P$1 | v7.77,31.8 7.46,31.49 6.47,31.49
  Bottom 0.152: U$17.P$1 8,32.64 8,32.03 v7.77,31.8 7.77,30.15 9.32,28.6 10.66,28.6 U2.2
N$3  (via drill 0.35)
  Top 0.152: U$16.P$2 6.68,41.38 v8,40.05 8.38,39.67 8.38,31.49 v8.38,30.45
  Bottom 0.152: v8,40.05 7.87,39.93 7.87,39.25 U$18.P$1 | 10.66,29.44 U2.3 9.36,29.46 v8.38,30.45
N$9  (via drill 0.35)
  Top 0.152: v20.87,8.71 21.94,8.71 8.A
  Bottom 0.152: v20.87,8.71 21.94,8.71 U$31.P$2
N$10  (via drill 0.35)
  Top 0.152: v18.36,8.71 19.43,8.71 4.A
  Bottom 0.152: v18.36,8.71 19.43,8.71 U$30.P$2
N$11  (via drill 0.35)
  Top 0.152: 2.A v16.91,7.57
  Bottom 0.152: v16.91,7.57 U$29.P$2
N$12  (via drill 0.35)
  Top 0.152: v13.94,7.57 13.94,8.25 14.32,8.63 1.A
  Bottom 0.152: v13.94,7.57 14.32,7.95 14.32,8.63 U$28.P$2
N$19
  Top 0.152: LED2.A U$24.P$2
N$20
  Top 0.152: U$23.P$2 10.59,46.05 10.59,48.03 LED1.A
N$21
  Top 0.152: U$25.P$2 15.62,46.05 15.62,48.03 LED3.A
N$22
  Top 0.152: U$26.P$2 18.21,46.05 18.21,48.03 LED4.A
RST  (via drill 0.35)
  Top 0.152: U$10.P$1 7.54,13.13 7.69,13.28 7.69,14.65 U$15.P$1 7.77,14.65 7.77,17.63 S2.2 7.84,17.7 v7.84,20.75 7.84,21.74 S2.1 | v9.9,34.31 9.9,33.78 v8.99,32.87
  Bottom 0.152: 8.68,32.87 8.68,33.09 8.53,33.25 7.46,33.25 7.16,32.94 7.16,26.24 7.62,25.78 7.62,20.98 v7.84,20.75 | 8.68,32.87 8.68,31.65 10.05,30.28 10.66,30.28 U2.4 | v9.9,34.31 13.86,38.28 13.86,38.89 13.79,38.96 13.79,40.56 U$27.P$5 | 8.68,32.87 v8.99,32.87
RST_1
  Top 0.152: 63.09,43.84 X1.5
  Top 0.305: SV1.9 68.47,30.02 68.47,34 63.09,39.38 63.09,43.84
RST_2
  Bottom 0.508: X2.5 47.53,26.57 53.08,26.57 55.18,24.46 58.78,24.46 62.82,28.5 SV1.10
RST_3
  Top 0.508: U$14.P$5 68.69,8.66 68.69,6.76 68.66,6.79 67.45,4.54 SV4.5
  Bottom 0.152: 70.02,31.04 SV1.11
  Bottom 0.305: U$14.P$5 68.87,14.68 68.87,21.31 69.96,22.4 70.42,22.4 71.47,23.45 71.47,29.18 70.02,30.63 70.02,31.04
RX  (via drill 0.35)
  Top 0.152: U$27.P$7 15.77,28.75 v16.91,29.89
  Bottom 0.152: v16.91,29.89 18.07,31.06 U2.20
RX_1  (via drill 0.35)
  Top 0.152: 65.07,38.78 65.07,38.73 65.1,38.71
  Top 0.305: X1.4 65.07,38.78 | v69.95,29.74 69.82,29.74 68.98,30.58 68.98,34.82 65.1,38.71
  Bottom 0.305: v69.95,29.74 70.18,29.51 70.42,29.51 71.01,28.92 71.01,25.54 69.91,24.43 69.58,24.43 68.98,23.84 68.98,22.4 SV1.4
RX_2
  Bottom 0.508: X2.4 52.4,25.08 55.31,22.17 58.78,22.17 60.02,23.42 SV1.6
RX_3  (via drill 0.35)
  Top 0.305: v69.9,40.05 67.59,40.05 v66.32,41.32
  Bottom 0.305: SV1.8 67.46,27.06 68.53,28.13 68.53,31.84 69.19,32.51 70.37,32.51 71.01,33.16 71.01,34 70.25,34.76 70.25,39.7 v69.9,40.05 | v66.32,41.32 66.25,41.32 64.02,43.56 64.02,49.34 U$14.P$7
SCL
  Bottom 0.508: SV2.5 56.89,27.25 55.31,27.25 53.48,29.08 X2.6
SDA  (via drill 0.35)
  Top 0.508: X2.7 47.57,31.08 50.83,27.82 v50.83,27.75
  Bottom 0.508: SV2.6 54,27.61 50.97,27.61 v50.83,27.75
SWO
  Top 0.508: SV4.6 64.37,11.58 U$14.P$4
SWO_A  (via drill 0.35)
  Top 0.152: v16.91,28.07 16.91,28.98 18.36,30.43 18.36,33.78 17.98,34.16 16.68,34.16 14.78,36.07 14.78,39.57 15.77,40.56 U$27.P$4
  Bottom 0.152: v16.91,28.07 16.91,26.47 U2.26
TCK
  Bottom 0.508: U$14.P$3 61.77,7.09 SV4.2
TCK_A  (via drill 0.35)
  Top 0.152: v21.64,30.28 21.64,31.49 21.33,31.8 21.33,36.6 20.72,37.21 20.72,40.79 19.43,42.09 18.67,42.09 17.83,41.25 17.83,40.64 U$27.P$3
  Bottom 0.152: v21.64,30.28 21.64,29.82 19.73,27.91 19.12,27.91 U2.24
TMS
  Top 0.508: SV4.4 64.53,6.76 64.6,6.76 U$14.P$2
TMS_A  (via drill 0.35)
  Top 0.152: v12.34,33.55 12.34,34.39 11.2,35.53 v11.2,38.81
  Bottom 0.152: v12.34,33.55 17.22,28.68 19.05,28.68 U2.23 | v11.2,38.81 11.2,39.5 12.49,40.79 12.49,41.02 14.4,42.92 16.53,42.92 18.06,41.4 18.13,41.4 18.89,40.64 19.73,40.64 U$27.P$2
TX  (via drill 0.35)
  Top 0.152: v16.27,30.54 15.47,29.73 15.47,3.64 14.41,2.58 U$27.P$6
  Bottom 0.152: U2.19 17.59,31.86 v16.27,30.54
TX_1
  Bottom 0.305: SV1.3 70,21.33 71.93,23.26 71.93,32.36 74.82,35.25 74.82,41.84 71.27,45.39 68.11,45.39 67.06,44.34 X1.3
TX_2
  Top 0.508: X2.3 54.4,23.08 55.31,22.17 68.75,22.17 SV1.5
TX_3  (via drill 0.35)
  Top 0.305: U$14.P$6 68.6,46.76 71.91,46.76 74.14,44.53 v74.14,35.91
  Bottom 0.305: v74.14,35.91 74.11,35.89 74.11,35.55 70.61,32.05 69.58,32.05 68.98,31.46 68.98,28.08 70,27.06 SV1.7

### Text on the board
tPlace: F | R | ON | OFF | C | B | L